# EAGLE design megacard_4 (EAGLE 4.16)
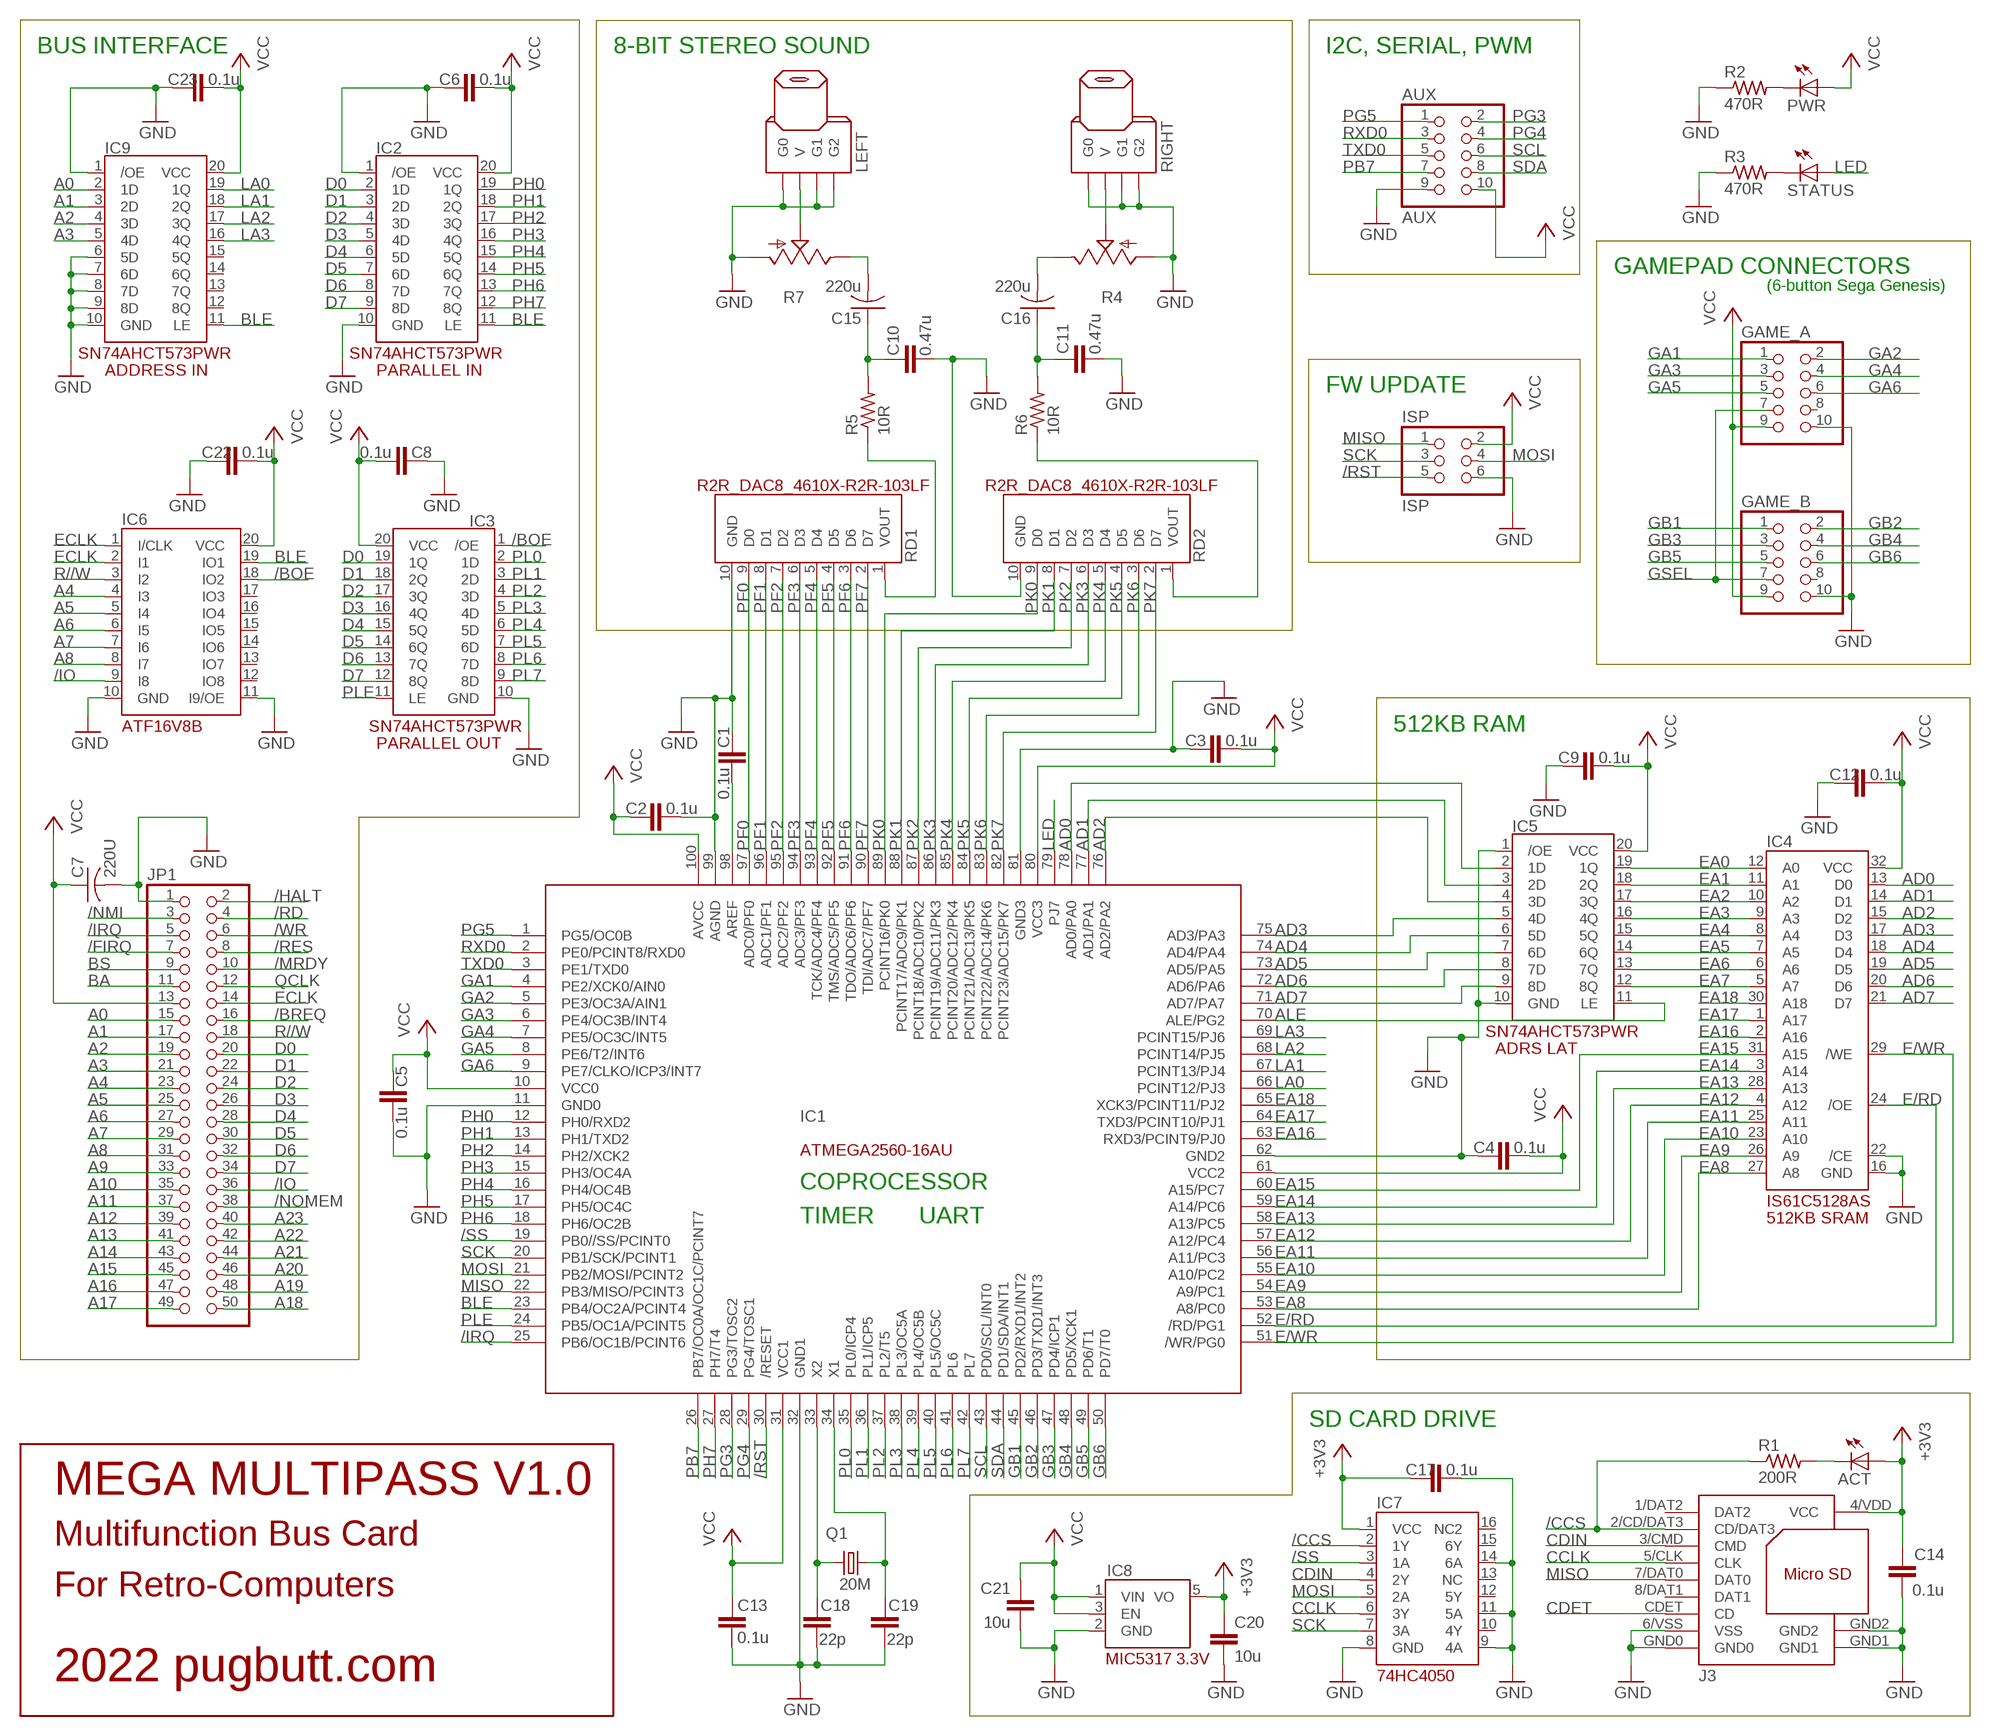
[diagram p0: schematic, sheet 1]

## Parts
ACT  LED3MM  [LED3MM]
AUX  AUX  PINHD-2X5  [2X05]
C1  0.1u  C-EUC0603  [C0603]
C2  0.1u  C-EUC0603  [C0603]
C3  0.1u  C-EUC0603  [C0603]
C4  0.1u  C-EUC0603  [C0603]
C5  0.1u  C-EUC0603  [C0603]
C6  0.1u  C-EUC0603  [C0603]
C7  220U  C-US025-050X050  [C025-050X050]
C8  0.1u  C-EUC0603  [C0603]
C9  0.1u  C-EUC0603  [C0603]
C10  0.47u  C-EUC0805  [C0805]
C11  0.47u  C-EUC0805  [C0805]
C12  0.1u  C-EUC0603  [C0603]
C13  0.1u  C-EUC0603  [C0603]
C14  0.1u  C-EUC0603  [C0603]
C15  220u  C-US025-050X050  [C025-050X050]
C16  220u  C-US025-050X050  [C025-050X050]
C17  0.1u  C-EUC0603  [C0603]
C18  22p  C-EUC0603  [C0603]
C19  22p  C-EUC0603  [C0603]
C20  10u  C-EUC0805  [C0805]
C21  10u  C-EUC0805  [C0805]
C22  0.1u  C-EUC0603  [C0603]
C23  0.1u  C-EUC0603  [C0603]
GAME_A  PINHD-2X5  [2X05]
GAME_B  PINHD-2X5  [2X05]
IC1  ATMEGA2560  [TQFP100]
IC2  SN74AHCT573PWR  [TSSOP20]
IC3  SN74AHCT573PWR  [TSSOP20]
IC4  IS61C5128AS  [SOIC32_11.3MM_WID]
IC5  SN74AHCT573PWR  [TSSOP20]
IC6  PLD_ATF16V8B  [DIL20]
IC7  CD74HC4050  [SO-16]
IC8  MIC5317_3.3V  [SOT23-5]
IC9  SN74AHCT573PWR  [TSSOP20]
ISP  ISP  PINHD-2X3  [2X03]
J3  MICROSD_AMPHENOL_GTFP084328  [MICROSD_AMPHENOL_GTFP08432B1HR]
JP1  PINHD-2X25  [2X25]
LEFT  RCA_CONN_CUI_RCJ-014_CP-1403-ND  [RCA_JACK_CUI_RCJ-014_CP-1403-ND]
PWR  LED3MM  [LED3MM]
Q1  20M  CRYSTALHC49U-V  [HC49U-V]
R1  200R  R-US_R0603  [R0603]
R2  470R  R-US_R0603  [R0603]
R3  470R  R-US_R0603  [R0603]
R4  TRIM_US-CA6V  [CA6V]
R5  10R  R-US_R0603  [R0603]
R6  10R  R-US_R0603  [R0603]
R7  TRIM_US-CA6V  [CA6V]
RD1  R2R_DAC8_4610X-R2R-103LF  [R2R_DAC_8BIT]
RD2  R2R_DAC8_4610X-R2R-103LF  [R2R_DAC_8BIT]
RIGHT  RCA_CONN_CUI_RCJ-014_CP-1403-ND  [RCA_JACK_CUI_RCJ-014_CP-1403-ND]
STATUS  LED3MM  [LED3MM]

## Nets
+3V3: ACT.A C14.1 C17.1 C20.1 IC7.1(VCC) IC8.5(VO) J3.4/VDD(VCC)
/BOE: IC3.1(/OE) IC6.18(IO2)
/BREQ: JP1.16
/CCS: IC7.2(1Y) J3.2/CD/DAT3(CD/DAT3) R1.1
/FIRQ: JP1.7
/HALT: JP1.2
/IO: IC6.9(I8) JP1.36
/IRQ: IC1.25(PB6/OC1B/PCINT6) JP1.5
/MRDY: JP1.10
/NMI: JP1.3
/NOMEM: JP1.38
/RD: JP1.4
/RES: JP1.8
/RST: IC1.30(/RESET) ISP.5
/SS: IC1.19(PB0//SS/PCINT0) IC7.3(1A)
/WR: JP1.6
A0: IC9.2(1D) JP1.15
A1: IC9.3(2D) JP1.17
A2: IC9.4(3D) JP1.19
A3: IC9.5(4D) JP1.21
A4: IC6.4(I3) JP1.23
A5: IC6.5(I4) JP1.25
A6: IC6.6(I5) JP1.27
A7: IC6.7(I6) JP1.29
A8: IC6.8(I7) JP1.31
A9: JP1.33
A10: JP1.35
A11: JP1.37
A12: JP1.39
A13: JP1.41
A14: JP1.43
A15: JP1.45
A16: JP1.47
A17: JP1.49
A18: JP1.50
A19: JP1.48
A20: JP1.46
A21: JP1.44
A22: JP1.42
A23: JP1.40
AD0: IC1.78(AD0/PA0) IC4.13(D0) IC5.2(1D)
AD1: IC1.77(AD1/PA1) IC4.14(D1) IC5.3(2D)
AD2: IC1.76(AD2/PA2) IC4.15(D2) IC5.4(3D)
AD3: IC1.75(AD3/PA3) IC4.17(D3) IC5.5(4D)
AD4: IC1.74(AD4/PA4) IC4.18(D4) IC5.6(5D)
AD5: IC1.73(AD5/PA5) IC4.19(D5) IC5.7(6D)
AD6: IC1.72(AD6/PA6) IC4.20(D6) IC5.8(7D)
AD7: IC1.71(AD7/PA7) IC4.21(D7) IC5.9(8D)
ALE: IC1.70(ALE/PG2) IC5.11(LE)
BA: JP1.11
BLE: IC1.23(PB4/OC2A/PCINT4) IC2.11(LE) IC6.19(IO1) IC9.11(LE)
BS: JP1.9
CCLK: IC7.6(3Y) J3.5/CLK(CLK)
CDET: J3.CDET(CD)
CDIN: IC7.4(2Y) J3.3/CMD(CMD)
D0: IC2.2(1D) IC3.19(1Q) JP1.20
D1: IC2.3(2D) IC3.18(2Q) JP1.22
D2: IC2.4(3D) IC3.17(3Q) JP1.24
D3: IC2.5(4D) IC3.16(4Q) JP1.26
D4: IC2.6(5D) IC3.15(5Q) JP1.28
D5: IC2.7(6D) IC3.14(6Q) JP1.30
D6: IC2.8(7D) IC3.13(7Q) JP1.32
D7: IC2.9(8D) IC3.12(8Q) JP1.34
E/RD: IC1.52(/RD/PG1) IC4.24(/OE)
E/WR: IC1.51(/WR/PG0) IC4.29(/WE)
EA0: IC4.12(A0) IC5.19(1Q)
EA1: IC4.11(A1) IC5.18(2Q)
EA2: IC4.10(A2) IC5.17(3Q)
EA3: IC4.9(A3) IC5.16(4Q)
EA4: IC4.8(A4) IC5.15(5Q)
EA5: IC4.7(A5) IC5.14(6Q)
EA6: IC4.6(A6) IC5.13(7Q)
EA7: IC4.5(A7) IC5.12(8Q)
EA8: IC1.53(A8/PC0) IC4.27(A8)
EA9: IC1.54(A9/PC1) IC4.26(A9)
EA10: IC1.55(A10/PC2) IC4.23(A10)
EA11: IC1.56(A11/PC3) IC4.25(A11)
EA12: IC1.57(A12/PC4) IC4.4(A12)
EA13: IC1.58(A13/PC5) IC4.28(A13)
EA14: IC1.59(A14/PC6) IC4.3(A14)
EA15: IC1.60(A15/PC7) IC4.31(A15)
EA16: IC1.63(RXD3/PCINT9/PJ0) IC4.2(A16)
EA17: IC1.64(TXD3/PCINT10/PJ1) IC4.1(A17)
EA18: IC1.65(XCK3/PCINT11/PJ2) IC4.30(A18)
ECLK: IC6.1(I/CLK) IC6.2(I1) JP1.14
GA1: GAME_A.1 IC1.4(PE2/XCK0/AIN0)
GA2: GAME_A.2 IC1.5(PE3/OC3A/AIN1)
GA3: GAME_A.3 IC1.6(PE4/OC3B/INT4)
GA4: GAME_A.4 IC1.7(PE5/OC3C/INT5)
GA5: GAME_A.5 IC1.8(PE6/T2/INT6)
GA6: GAME_A.6 IC1.9(PE7/CLKO/ICP3/INT7)
GB1: GAME_B.1 IC1.45(PD2/RXD1/INT2)
GB2: GAME_B.2 IC1.46(PD3/TXD1/INT3)
GB3: GAME_B.3 IC1.47(PD4/ICP1)
GB4: GAME_B.4 IC1.48(PD5/XCK1)
GB5: GAME_B.5 IC1.49(PD6/T1)
GB6: GAME_B.6 IC1.50(PD7/T0)
GND: AUX.9 C1.1 C2.2 C3.1 C4.1 C5.2 C6.1 C7.2 C8.1 C9.1 C10.2 C11.2 C12.1 C13.2 C14.2 C17.2 C18.2 C19.2 C20.2 C21.2 C22.1 C23.1 GAME_A.10 GAME_B.10 IC1.11(GND0) IC1.32(GND1) IC1.62(GND2) IC1.81(GND3) IC1.99(AGND) IC2.1(/OE) IC2.10(GND) IC3.10(GND) IC4.16(GND) IC4.22(/CE) IC5.1(/OE) IC5.10(GND) IC6.10(GND) IC6.11(I9/OE) IC7.8(GND) IC7.9(4A) IC7.11(5A) IC7.14(6A) IC8.2(GND) IC9.1(/OE) IC9.6(5D) IC9.7(6D) IC9.8(7D) IC9.9(8D) IC9.10(GND) ISP.6 J3.6/VSS(VSS) J3.GND0 J3.GND1 J3.GND2 JP1.1 LEFT.G0 LEFT.G1 LEFT.G2 R2.1 R3.1 R4.A R7.A RD1.10(GND) RD2.10(GND) RIGHT.G0 RIGHT.G1 RIGHT.G2
GSEL: GAME_A.7 GAME_B.7
LA0: IC1.66(PCINT12/PJ3) IC9.19(1Q)
LA1: IC1.67(PCINT13/PJ4) IC9.18(2Q)
LA2: IC1.68(PCINT14/PJ5) IC9.17(3Q)
LA3: IC1.69(PCINT15/PJ6) IC9.16(4Q)
LED: IC1.79(PJ7) STATUS.A
LOUT: R6.1 RD2.1(VOUT)
MISO: IC1.22(PB3/MISO/PCINT3) ISP.1 J3.7/DAT0(DAT0)
MOSI: IC1.21(PB2/MOSI/PCINT2) IC7.5(2A) ISP.4
N$1: PWR.K(C) R2.2
N$2: C11.1 C16.1 R6.2
N$3: ACT.K(C) R1.2
N$4: C18.1 IC1.33(X2) Q1.2
N$5: C19.1 IC1.34(X1) Q1.1
N$6: LEFT.V R7.S
N$7: R4.S RIGHT.V
N$8: R3.2 STATUS.K(C)
N$10: C15.2 R7.E
N$11: C10.1 C15.1 R5.2
N$12: C16.2 R4.E
N$27: C1.2 IC1.98(AREF)
PB7: AUX.7 IC1.26(PB7/OC0A/OC1C/PCINT7)
PF0: IC1.97(ADC0/PF0) RD1.9(D0)
PF1: IC1.96(ADC1/PF1) RD1.8(D1)
PF2: IC1.95(ADC2/PF2) RD1.7(D2)
PF3: IC1.94(ADC3/PF3) RD1.6(D3)
PF4: IC1.93(TCK/ADC4/PF4) RD1.5(D4)
PF5: IC1.92(TMS/ADC5/PF5) RD1.4(D5)
PF6: IC1.91(TDO/ADC6/PF6) RD1.3(D6)
PF7: IC1.90(TDI/ADC7/PF7) RD1.2(D7)
PG3: AUX.2 IC1.28(PG3/TOSC2)
PG4: AUX.4 IC1.29(PG4/TOSC1)
PG5: AUX.1 IC1.1(PG5/OC0B)
PH0: IC1.12(PH0/RXD2) IC2.19(1Q)
PH1: IC1.13(PH1/TXD2) IC2.18(2Q)
PH2: IC1.14(PH2/XCK2) IC2.17(3Q)
PH3: IC1.15(PH3/OC4A) IC2.16(4Q)
PH4: IC1.16(PH4/OC4B) IC2.15(5Q)
PH5: IC1.17(PH5/OC4C) IC2.14(6Q)
PH6: IC1.18(PH6/OC2B) IC2.13(7Q)
PH7: IC1.27(PH7/T4) IC2.12(8Q)
PK0: IC1.89(PCINT16/PK0) RD2.9(D0)
PK1: IC1.88(PCINT17/ADC9/PK1) RD2.8(D1)
PK2: IC1.87(PCINT18/ADC10/PK2) RD2.7(D2)
PK3: IC1.86(PCINT19/ADC11/PK3) RD2.6(D3)
PK4: IC1.85(PCINT20/ADC12/PK4) RD2.5(D4)
PK5: IC1.84(PCINT21/ADC13/PK5) RD2.4(D5)
PK6: IC1.83(PCINT22/ADC14/PK6) RD2.3(D6)
PK7: IC1.82(PCINT23/ADC15/PK7) RD2.2(D7)
PL0: IC1.35(PL0/ICP4) IC3.2(1D)
PL1: IC1.36(PL1/ICP5) IC3.3(2D)
PL2: IC1.37(PL2/T5) IC3.4(3D)
PL3: IC1.38(PL3/OC5A) IC3.5(4D)
PL4: IC1.39(PL4/OC5B) IC3.6(5D)
PL5: IC1.40(PL5/OC5C) IC3.7(6D)
PL6: IC1.41(PL6) IC3.8(7D)
PL7: IC1.42(PL7) IC3.9(8D)
PLE: IC1.24(PB5/OC1A/PCINT5) IC3.11(LE)
QCLK: JP1.12
R//W: IC6.3(I2) JP1.18
ROUT: R5.1 RD1.1(VOUT)
RXD0: AUX.3 IC1.2(PE0/PCINT8/RXD0)
SCK: IC1.20(PB1/SCK/PCINT1) IC7.7(3A) ISP.3
SCL: AUX.6 IC1.43(PD0/SCL/INT0)
SDA: AUX.8 IC1.44(PD1/SDA/INT1)
TXD0: AUX.5 IC1.3(PE1/TXD0)
VCC: AUX.10 C2.1 C3.2 C4.2 C5.1 C6.2 C7.1 C8.2 C9.2 C12.2 C13.1 C21.1 C22.2 C23.2 GAME_A.9 GAME_B.9 IC1.10(VCC0) IC1.31(VCC1) IC1.61(VCC2) IC1.80(VCC3) IC1.100(AVCC) IC2.20(VCC) IC3.20(VCC) IC4.32(VCC) IC5.20(VCC) IC6.20(VCC) IC8.1(VIN) IC8.3(EN) IC9.20(VCC) ISP.2 JP1.13 PWR.A
Unconnected: GAME_A.8 GAME_B.8 IC6.12(IO8) IC6.13(IO7) IC6.14(IO6) IC6.15(IO5) IC6.16(IO4) IC6.17(IO3) IC7.10(4Y) IC7.12(5Y) IC7.13(NC) IC7.15(6Y) IC7.16(NC2) IC9.12(8Q) IC9.13(7Q) IC9.14(6Q) IC9.15(5Q) J3.1/DAT2(DAT2) J3.8/DAT1(DAT1)

## Notes on the sheet
- BUS INTERFACE | 8-BIT STEREO SOUND | I2C, SERIAL, PWM
- GAMEPAD CONNECTORS
- (6-button Sega Genesis)
- ADDRESS IN | PARALLEL IN
- FW UPDATE
- 512KB RAM
- PARALLEL OUT
- ADRS LAT
- COPROCESSOR
- TIMER | UART | 512KB SRAM
- SD CARD DRIVE
- MEGA MULTIPASS V1.0
- Multifunction Bus Card
- For Retro-Computers
- 2022 pugbutt.com

## Library data of the parts
ACT PWR STATUS = led:LED: LED OSRAM: - CHIPLED LG R971, LG N971, LY N971, LG Q971, LY Q971, LO R971, LY R971 LH N974, LH R974 LS Q976, LO Q976, LY Q976 LO Q996 - Hyper CHIPLED LW Q18S LB Q993, LB Q99A, LB R99A - SideLED LS A670, LO A670, LY A670, LG A670, LP A670 LB A673, LV A673, LT A673, LW A673 LH A674 LY A675 LS A676, LA A676, LO A676, LY A676, LW A676 LS A679, LY A679, LG A679 - Hyper Micro SIDELED® LS Y876, LA Y876, LO Y876, LY Y876 LT Y87S - SmartLED LW L88C, LW L88S LB L89C, LB L89S, LG L890 LS L89K, LO L89K, LY L89K LS L896, LA L896, LO L896, LY L896 - TOPLED LS T670, LO T670, LY T670, LG T670, LP T670 LSG T670, LSP T670, LSY T670, LOP T670, LYG T670 LG T671, LOG T671, LSG T671 LB T673, LV T673, LT T673, LW T673 LH T674 LS T676, LA T676, LO T676, LY T676, LB T676, LH T676, LSB T676, LW T676 LB T67C, LV T67C, LT T67C, LS T67K, LO T67K, LY T67K, LW E67C LS E67B, LA E67B, LO E67B, LY E67B, LB E67C, LV E67C, LT E67C LW T67C LS T679, LY T679, LG T679 LS T770, LO T770, LY T770, LG T770, LP T770 LB T773, LV T773, LT T773, LW T773 LH T774 LS E675, LA E675, LY E675, LS T675 LS T776, LA T776, LO T776, LY T776, LB T776 LHGB T686 LT T68C, LB T68C - Hyper Mini TOPLED® LB M676 - Mini TOPLED Santana® LG M470 LS M47K, LO M47K, LY M47K Source: http://www.osram.convergy.de - LUMILED® LXK2-PW12-R00, LXK2-PW12-S00, LXK2-PW14-U00, LXK2-PW14-V00 LXK2-PM12-R00, LXK2-PM12-S00, LXK2-PM14-U00 LXK2-PE12-Q00, LXK2-PE12-R00, LXK2-PE12-S00, LXK2-PE14-T00, LXK2-PE14-U00 LXK2-PB12-K00, LXK2-PB12-L00, LXK2-PB12-M00, LXK2-PB14-N00, LXK2-PB14-P00, LXK2-PB14-Q00 LXK2-PR12-L00, LXK2-PR12-M00, LXK2-PR14-Q00, LXK2-PR14-R00 LXK2-PD12-Q00, LXK2-PD12-R00, LXK2-PD12-S00 LXK2-PH12-R00, LXK2-PH12-S00 LXK2-PL12-P00, LXK2-PL12-Q00, LXK2-PL12-R00 Source: www.luxeon.com
AUX GAME_A GAME_B = pinhead:PINHD-2X5: PIN HEADER
C1-C6 C8-C14 C17-C23 = rcl:C-EU: CAPACITOR, European symbol
C7 C15 C16 = rcl:C-US: CAPACITOR, American symbol
IC1 = 02_atmel:ATMEGA2560
IC2 IC3 IC5 IC9 = 07-Retrocomputing:SN74AHCT573PWR
IC4 = 07-Retrocomputing:IS61C5128AS
IC6 = 07-Retrocomputing:PLD_ATF16V8B
IC7 = 07-Retrocomputing:CD74HC4050
IC8 = 07-Retrocomputing:MIC5317_3.3V
ISP = pinhead:PINHD-2X3: PIN HEADER
J3 = 07-Retrocomputing:MICROSD_AMPHENOL_GTFP084328
JP1 = pinhead:PINHD-2X25: PIN HEADER
LEFT RIGHT = 07-Retrocomputing:RCA_CONN_CUI_RCJ-014_CP-1403-ND
Q1 = crystal:CRYSTAL: CRYSTAL
R1-R3 R5 R6 = rcl:R-US_: RESISTOR, American symbol
R4 R7 = pot:TRIM_US-: POTENTIOMETER
RD1 RD2 = 07-Retrocomputing:R2R_DAC8_4610X-R2R-103LF

## Net classes
0 default: width 0.203 mm, drill 0.203 mm, clearance 0.254 mm
1 supply: width 0.61 mm, drill 0.203 mm, clearance 0.305 mm

## Board
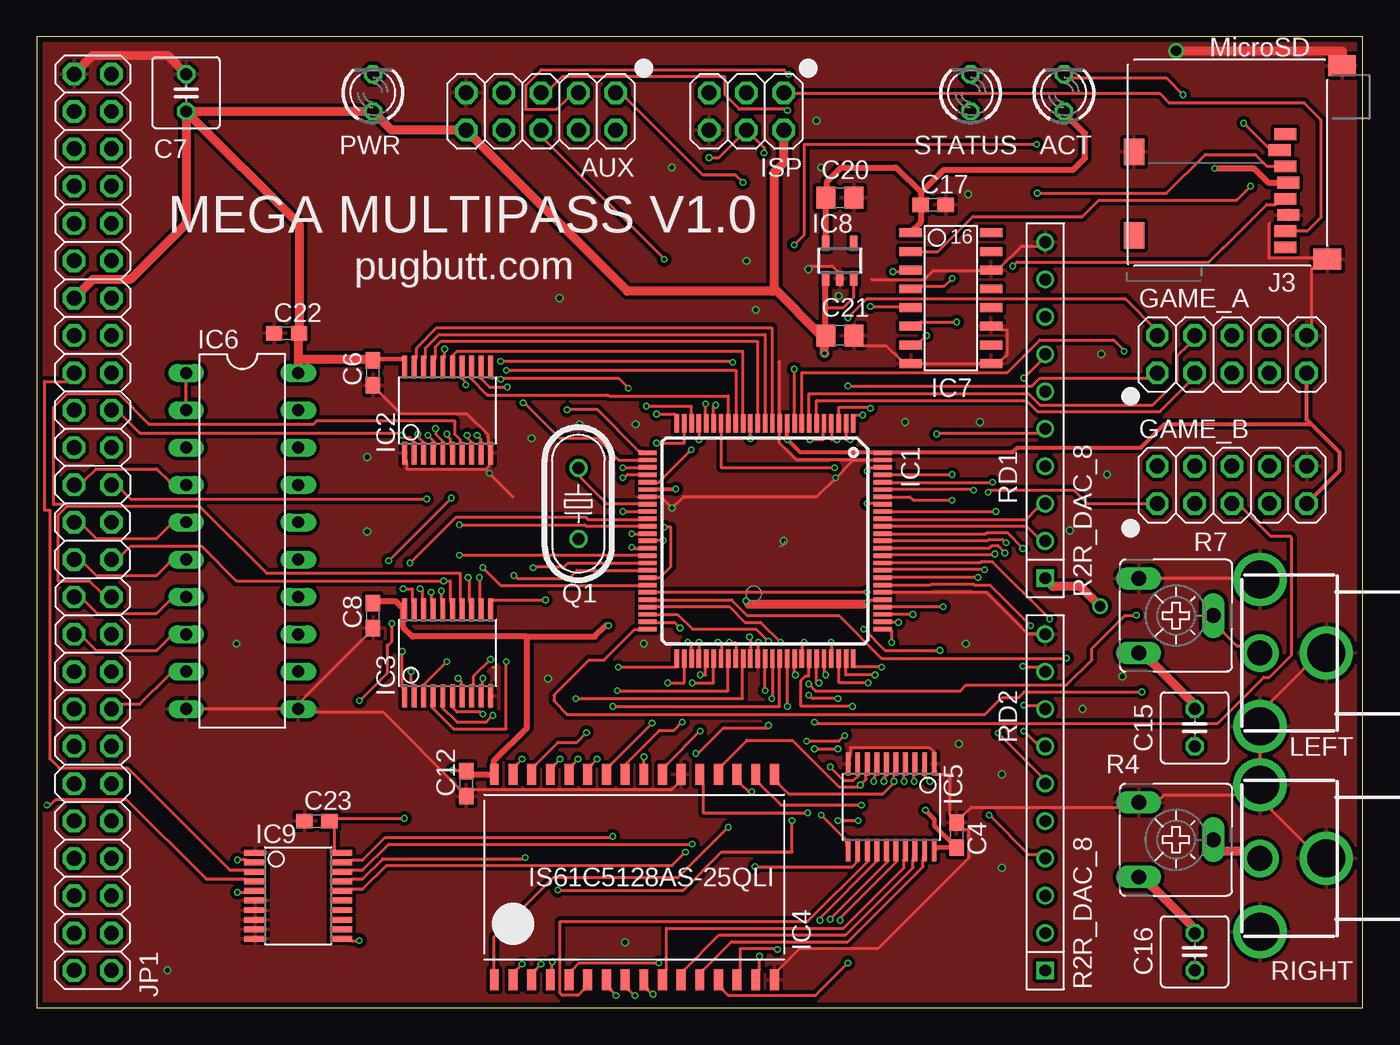
[diagram p1: board, top side]
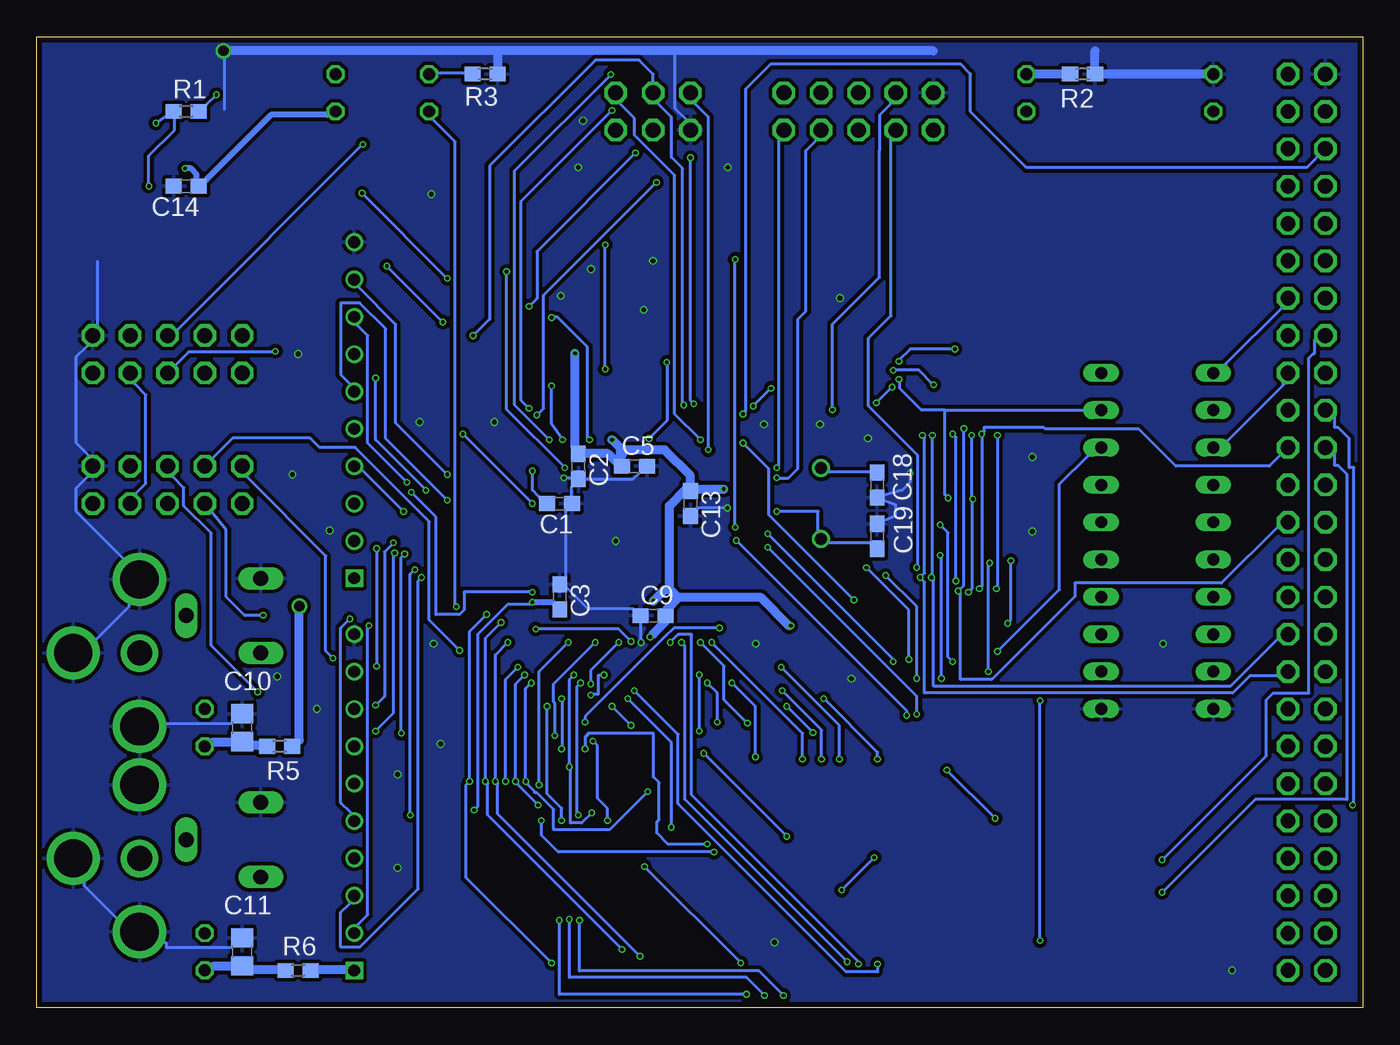
[diagram p2: board, bottom side, seen from below]

Size 90.17 x 66.04 mm. Coordinates in mm from the lower left corner, seen from the top.
Outline: 0,0 90.17,0 90.17,66.04 0,66.04 0,0
Copper layers (1*2*15*16): Top 0.0356mm / dielectric 0.1702mm / Route2 0.0178mm / dielectric 1.1938mm / Route15 0.0178mm / dielectric 0.1702mm / Bottom 0.0356mm
Design rules "oshpark-4layer": minimum track width 5mil, minimum drill 10mil, track to track 5mil, track to pad 5mil, pad to pad 5mil, via to via 5mil, smd to smd 5mil, copper to edge 15mil, drill to drill 6mil, minimum pad ring 4mil, minimum via ring 4mil, stop-mask expansion 2.5mil, vias tented up to drill 0mil, thermal gap 10mil

### Footprints (pad centres in the part's own frame; a part is rotated, then mirrored left to right if it is on the bottom)
LED3MM = drill 0.813 octagon: A -1.27,0; K 1.27,0
2X05 = drill 1.016 octagon: 1 -5.08,-1.27; 2 -5.08,1.27; 3 -2.54,-1.27; 4 -2.54,1.27; 5 0,-1.27; 6 0,1.27; 7 2.54,-1.27; 8 2.54,1.27; 9 5.08,-1.27; 10 5.08,1.27
C0603 = smd 1.1 x 1: 1 -0.85,0; 2 0.85,0
C025-050X050 = drill 0.813 octagon: 1 -1.27,0; 2 1.27,0
C0805 = smd 1.3 x 1.5: 1 -0.95,0; 2 0.95,0
TQFP100 = smd 1.25 x 0.3: 1 -8,6; 2 -8,5.5; 3 -8,5; 4 -8,4.5; 5 -8,4; 6 -8,3.5; 7 -8,3; 8 -8,2.5; 9 -8,2; 10 -8,1.5; 11 -8,1; 12 -8,0.5; 13 -8,0; 14 -8,-0.5; 15 -8,-1; 16 -8,-1.5; 17 -8,-2; 18 -8,-2.5; 19 -8,-3; 20 -8,-3.5; 21 -8,-4; 22 -8,-4.5; 23 -8,-5; 24 -8,-5.5; 25 -8,-6; 51 8,-6; 52 8,-5.5; 53 8,-5; 54 8,-4.5; 55 8,-4; 56 8,-3.5; 57 8,-3; 58 8,-2.5; 59 8,-2; 60 8,-1.5; 61 8,-1; 62 8,-0.5; 63 8,0; 64 8,0.5; 65 8,1; 66 8,1.5; 67 8,2; 68 8,2.5; 69 8,3; 70 8,3.5; 71 8,4; 72 8,4.5; 73 8,5; 74 8,5.5; 75 8,6 | smd 0.3 x 1.25: 26 -6,-8; 27 -5.5,-8; 28 -5,-8; 29 -4.5,-8; 30 -4,-8; 31 -3.5,-8; 32 -3,-8; 33 -2.5,-8; 34 -2,-8; 35 -1.5,-8; 36 -1,-8; 37 -0.5,-8; 38 0,-8; 39 0.5,-8; 40 1,-8; 41 1.5,-8; 42 2,-8; 43 2.5,-8; 44 3,-8; 45 3.5,-8; 46 4,-8; 47 4.5,-8; 48 5,-8; 49 5.5,-8; 50 6,-8; 76 6,8; 77 5.5,8; 78 5,8; 79 4.5,8; 80 4,8; 81 3.5,8; 82 3,8; 83 2.5,8; 84 2,8; 85 1.5,8; 86 1,8; 87 0.5,8; 88 0,8; 89 -0.5,8; 90 -1,8; 91 -1.5,8; 92 -2,8; 93 -2.5,8; 94 -3,8; 95 -3.5,8; 96 -4,8; 97 -4.5,8; 98 -5,8; 99 -5.5,8; 100 -6,8
TSSOP20 = smd 1.5 x 0.35: 1 -2.925,2.925; 2 -2.925,2.275; 3 -2.925,1.625; 4 -2.925,0.975; 5 -2.925,0.325; 6 -2.925,-0.325; 7 -2.925,-0.975; 8 -2.925,-1.625; 9 -2.925,-2.275; 10 -2.925,-2.925; 11 2.925,-2.925; 12 2.925,-2.275; 13 2.925,-1.625; 14 2.925,-0.975; 15 2.925,-0.325; 16 2.925,0.325; 17 2.925,0.975; 18 2.925,1.625; 19 2.925,2.275; 20 2.925,2.925
SOIC32_11.3MM_WID = smd 1.4 x 0.6: 1 -6.985,9.525; 2 -6.985,8.255; 3 -6.985,6.985; 4 -6.985,5.715; 5 -6.985,4.445; 6 -6.985,3.175; 7 -6.985,1.905; 8 -6.985,0.635; 9 -6.985,-0.635; 10 -6.985,-1.905; 11 -6.985,-3.175; 12 -6.985,-4.445; 13 -6.985,-5.715; 14 -6.985,-6.985; 15 -6.985,-8.255; 16 -6.985,-9.525; 17 6.985,-9.525; 18 6.985,-8.255; 19 6.985,-6.985; 20 6.985,-5.715; 21 6.985,-4.445; 22 6.985,-3.175; 23 6.985,-1.905; 24 6.985,-0.635; 25 6.985,0.635; 26 6.985,1.905; 27 6.985,3.175; 28 6.985,4.445; 29 6.985,5.715; 30 6.985,6.985; 31 6.985,8.255; 32 6.985,9.525
DIL20 = drill 0.813 long: 1 -11.43,-3.81; 2 -8.89,-3.81; 3 -6.35,-3.81; 4 -3.81,-3.81; 5 -1.27,-3.81; 6 1.27,-3.81; 7 3.81,-3.81; 8 6.35,-3.81; 9 8.89,-3.81; 10 11.43,-3.81; 11 11.43,3.81; 12 8.89,3.81; 13 6.35,3.81; 14 3.81,3.81; 15 1.27,3.81; 16 -1.27,3.81; 17 -3.81,3.81; 18 -6.35,3.81; 19 -8.89,3.81; 20 -11.43,3.81
SO-16 = smd 0.61 x 1.524: 1 -4.445,-2.794; 2 -3.175,-2.794; 3 -1.905,-2.794; 4 -0.635,-2.794; 5 0.635,-2.794; 6 1.905,-2.794; 7 3.175,-2.794; 8 4.445,-2.794; 9 4.445,2.667; 10 3.175,2.667; 11 1.905,2.667; 12 0.635,2.667; 13 -0.635,2.667; 14 -1.905,2.667; 15 -3.175,2.667; 16 -4.445,2.667
SOT23-5 = smd 0.5 x 1: 1 -0.95,-1.2; 2 0,-1.2; 3 0.95,-1.2; 4 0.95,1.2; 5 -0.95,1.2
2X03 = drill 1.016 octagon: 1 -2.54,-1.27; 2 -2.54,1.27; 3 0,-1.27; 4 0,1.27; 5 2.54,-1.27; 6 2.54,1.27
MICROSD_AMPHENOL_GTFP08432B1HR = smd 0.8 x 1.5: 1/DAT2 1.95,-10.3; 2/CD/DAT3 0.85,-9.9; 3/CMD -0.25,-10.3; 4/VDD -1.35,-10.5; 5/CLK -2.45,-10.3; 6/VSS -3.55,-10.5; 7/DAT0 -4.65,-10.3; 8/DAT1 -5.75,-10.3 | smd 1.8 x 1.4: CDET -4.95,0; GND0 0.75,0 | smd 1.4 x 1.9: GND1 -6.55,-13.15; GND2 6.6,-14.15
2X25 = drill 1.016 octagon: 1 -30.48,-1.27; 2 -30.48,1.27; 3 -27.94,-1.27; 4 -27.94,1.27; 5 -25.4,-1.27; 6 -25.4,1.27; 7 -22.86,-1.27; 8 -22.86,1.27; 9 -20.32,-1.27; 10 -20.32,1.27; 11 -17.78,-1.27; 12 -17.78,1.27; 13 -15.24,-1.27; 14 -15.24,1.27; 15 -12.7,-1.27; 16 -12.7,1.27; 17 -10.16,-1.27; 18 -10.16,1.27; 19 -7.62,-1.27; 20 -7.62,1.27; 21 -5.08,-1.27; 22 -5.08,1.27; 23 -2.54,-1.27; 24 -2.54,1.27; 25 0,-1.27; 26 0,1.27; 27 2.54,-1.27; 28 2.54,1.27; 29 5.08,-1.27; 30 5.08,1.27; 31 7.62,-1.27; 32 7.62,1.27; 33 10.16,-1.27; 34 10.16,1.27; 35 12.7,-1.27; 36 12.7,1.27; 37 15.24,-1.27; 38 15.24,1.27; 39 17.78,-1.27; 40 17.78,1.27; 41 20.32,-1.27; 42 20.32,1.27; 43 22.86,-1.27; 44 22.86,1.27; 45 25.4,-1.27; 46 25.4,1.27; 47 27.94,-1.27; 48 27.94,1.27; 49 30.48,-1.27; 50 30.48,1.27
RCA_JACK_CUI_RCJ-014_CP-1403-ND = drill 2.6 round: G0 -5,0; G1 0,4.5; G2 5,0 | drill 1.7 round: V 0,0
HC49U-V = drill 0.813 round: 1 -2.413,0; 2 2.413,0
R0603 = smd 1.1 x 1: 1 -0.85,0; 2 0.85,0
CA6V = drill 1.016 long: A -2.54,-2.54; E 2.54,-2.54; S 0,2.54
R2R_DAC_8BIT = drill 0.8 square: 1 -11.43,0 | drill 0.8 round: 2 -8.89,0; 3 -6.35,0; 4 -3.81,0; 5 -1.27,0; 6 1.27,0; 7 3.81,0; 8 6.35,0; 9 8.89,0; 10 11.43,0

### Placement (x,y rotation side)
ACT  69.85,62.23 90 top
AUX  34.29,60.96 180 top
C1  54.61,34.29 180 bottom
C2  53.34,36.83 270 bottom
C3  54.61,27.94 270 bottom
C4  62.55,11.75 270 top
C5  49.53,36.83 0 bottom
C6  22.86,43.18 90 top
C7  10.16,62.23 90 top
C8  22.86,26.67 90 top
C9  48.26,26.67 0 bottom
C10  76.2,19.05 90 bottom
C11  76.2,3.81 90 bottom
C12  29.21,15.24 90 top
C13  45.72,34.29 270 bottom
C14  80.01,55.88 180 bottom
C15  78.74,19.05 90 top
C16  78.74,3.81 90 top
C17  60.96,54.61 0 top
C18  33.02,35.56 270 bottom
C19  33.02,32.07 90 bottom
C20  54.61,55.09 0 top
C21  54.61,45.72 0 top
C22  16.99,45.88 0 top
C23  19.05,12.7 0 top
GAME_A  81.28,44.45 0 top
GAME_B  81.28,35.56 0 top
IC1  49.53,31.75 270 top
IC2  27.94,40.64 90 top
IC3  27.94,24.13 90 top
IC4  40.64,8.89 90 top
IC5  58.1,13.65 270 top
IC6  13.97,31.75 270 top
IC7  62.23,48.26 270 top
IC8  54.61,50.8 0 top
IC9  17.78,7.62 0 top
ISP  48.26,60.96 180 top
J3  74.61,57.47 90 top
JP1  3.81,33.02 270 top
LEFT  83.19,24.13 270 top
PWR  22.86,62.23 90 top
Q1  36.83,34.29 90 top
R1  80.01,60.96 0 bottom
R2  19.05,63.5 180 bottom
R3  59.69,63.5 180 bottom
R4  77.47,11.43 270 top
R5  73.66,17.78 180 bottom
R6  72.39,2.54 180 bottom
R7  77.47,26.67 270 top
RD1  68.58,40.64 90 top
RD2  68.58,13.97 90 top
RIGHT  83.19,10.16 270 top
STATUS  63.5,62.23 90 top

### Tracks (layer width: path | path; a pad name or v marks a point on that pad's centre or on a via)
+3V3  (via drill 0.25)
  Top 0.203: 59.52,52.78 IC7.1 59.37,52.7 | 60.09,54.61 C17.1 60.11,55.43 | C20.1 53.74,55.17 | C20.1 | 53.74,55.09 | C20.1 53.74,55.09
  Top 0.406: IC8.5 C20.1 | 59.37,52.7 60.11,53.44 C17.1 60.11,55.46 58.42,57.15 54.69,57.15 53.74,56.2 53.74,55.09 | 60.11,55.43 61.67,56.99 70.48,56.99 71.28,57.78 71.28,59.45 69.85,60.88 ACT.A | v80.09,57.09 82.77,57.09 83.74,56.12 85.09,56.12 J3.4/VDD
  Bottom 0.203: 78.64,56.31 C14.1
  Bottom 0.406: 78.64,56.31 74.22,60.73 70.41,60.73 ACT.A | v80.09,57.09 79.71,57.09 79.3,56.67 79.3,56.04 79.14,55.88 C14.1
/BOE  (via drill 0.25)
  Top 0.203: v24.84,24.23 24.84,21.95 IC3.1
  Bottom 0.203: v24.84,24.23 20.62,28.45 20.62,35.61 18.67,37.57 IC6.18
/CCS  (via drill 0.25)
  Top 0.203: IC7.2 61.28,51.44 63.66,53.82 71.12,53.82 72.23,54.93 81.6,54.93 v82.55,55.88 | J3.2/CD/DAT3 83.92,58.32 v82.07,60.17
  Bottom 0.203: v82.55,55.88 82.55,57.94 80.8,59.69 80.8,60.96 | R1.1 80.86,61.06 80.8,61.12 80.8,60.96 | 80.8,60.96 R1.1 | R1.1 80.96,60.96 v82.07,60.17
/IO
  Top 0.203: IC6.9 8.99,22.63 7.01,20.65 5.79,20.65 JP1.36
/IRQ  (via drill 0.25)
  Top 0.203: v42.14,40.39 43.36,40.39 43.43,40.31 IC1.25
  Bottom 0.203: v42.14,40.39 41.99,40.54 41.99,62.46 40.28,64.16 27.33,64.16 26.67,63.5 26.67,60.96 22.86,57.15 3.81,57.15 JP1.5
/RST  (via drill 0.25)
  Top 0.203: v44.5,37.95 42.29,35.74 42.14,35.74 IC1.30
  Bottom 0.203: v44.5,37.95 44.5,60.58 45.41,61.49 ISP.5
/SS  (via drill 0.25)
  Top 0.203: v54.25,36.73 46.56,36.73 46.56,39.17 IC1.19 | v58.22,50.06 58.75,50.06 IC7.3
  Bottom 0.203: v54.25,36.73 58.22,40.69 v58.22,50.06
A0  (via drill 0.25)
  Top 0.203: v13.64,10.06 14.17,10.06 IC9.2
  Bottom 0.203: v13.64,10.06 6.55,17.14 6.55,20.95 6.1,21.41 3.66,21.41 3.66,44.2 3.35,44.5 3.28,44.5 3.28,45.41 JP1.15
A1
  Top 0.203: IC9.3 14.17,9.37 13.11,9.37 6.17,16.31 1.52,16.31 0.91,16.92 0.91,33.83 0.53,33.83 0.53,42.6 2.06,42.6 JP1.17
A2  (via drill 0.25)
  Top 0.203: v0.69,13.79 0.91,13.79 1.29,14.17 6.1,14.17 11.51,8.76 14.17,8.76 IC9.4
  Bottom 0.203: v0.69,13.79 0.61,13.79 0.61,36.73 0.91,36.73 0.91,38.71 1.68,39.47 1.91,39.47 1.91,40.23 JP1.19
A3  (via drill 0.25)
  Top 0.203: v13.64,7.85 14.17,7.85 IC9.5
  Bottom 0.203: v13.64,7.85 7.32,14.17 1.07,14.17 1.07,36.27 1.68,36.88 1.91,36.88 1.91,37.72 JP1.21
A4
  Top 0.203: IC6.4 8.99,35.81 8.15,36.65 4.04,36.65 3.28,35.89 JP1.23
A5
  Top 0.203: IC6.5 8.99,32.77 8.15,31.93 4.04,31.93 3.28,32.69 JP1.25
A6
  Top 0.203: IC6.6 8.99,30.25 8.15,29.41 4.04,29.41 3.28,30.18 JP1.27
A7
  Top 0.203: IC6.7 8.99,27.66 8.15,26.82 4.12,26.82 3.28,27.66 JP1.29
A8
  Top 0.203: IC6.8 8.99,25.15 8.15,24.31 4.04,24.31 3.28,25.07 JP1.31
AD0  (via drill 0.25)
  Top 0.203: v59.59,26.75 58.14,26.75 IC1.78 | v60.73,15.39 60.27,15.85 IC5.2 | v55.17,3.05 52.96,0.84 47.02,0.84 46.63,1.22 IC4.13
  Bottom 0.203: v59.59,26.75 60.73,25.6 v60.73,15.39 60.96,15.16 60.96,8.84 v55.17,3.05
AD1  (via drill 0.25)
  Top 0.203: v58.6,26.21 58.14,26.21 IC1.77 | v59.66,15.39 59.66,15.85 IC5.3 | v50.37,3.96 50.29,4.04 47.85,4.04 47.85,2.59 IC4.14
  Bottom 0.203: v58.6,26.21 59.66,25.15 v59.66,15.39 59.51,15.24 59.51,13.11 v50.37,3.96
AD2  (via drill 0.25)
  Top 0.203: v58.14,24.84 58.14,25.6 IC1.76 | v58.98,15.39 58.98,15.85 IC5.4 | v49.15,3.5 49.15,2.59 IC4.15
  Bottom 0.203: v58.14,24.84 58.98,24 v58.98,15.39 58.83,15.24 58.83,13.18 v49.15,3.5
AD3  (via drill 0.25)
  Top 0.203: v57.45,23.16 55.63,23.16 IC1.75 | IC5.5 58.29,15.85 v58.29,15.39 58.22,15.24 57.53,14.55 51.13,14.55 50.44,15.24 IC4.17
  Bottom 0.203: v57.45,23.16 58.29,22.33 v58.29,15.39
AD4  (via drill 0.25)
  Top 0.203: v57,22.63 55.02,22.63 55.02,23.16 IC1.74 | v57.61,15.39 57.61,15.7 57.68,15.7 57.84,15.85 IC5.6 | v56.08,13.79 50.6,13.79 49.15,15.24 IC4.18
  Bottom 0.203: v57,22.63 57.61,22.02 v57.61,15.39 57.45,15.24 57.45,15.16 v56.08,13.79
AD5  (via drill 0.25)
  Top 0.203: v56.54,22.1 54.56,22.1 54.56,23.16 IC1.73 | v56.92,15.39 56.92,15.62 57,15.62 57,15.85 IC5.7 | v48.62,14.71 48.39,14.71 47.85,15.24 IC4.19
  Bottom 0.203: v56.54,22.1 56.92,21.72 v56.92,15.39 56.77,15.24 56.77,15.16 56.31,14.71 56.31,14.63 56.16,14.63 55.02,13.49 55.02,12.12 51.21,12.12 v48.62,14.71
AD6  (via drill 0.25)
  Top 0.203: v54.03,24.84 54.03,24.31 IC1.72 | IC5.8 56.39,15.85 56.39,15.54 v56.01,15.16 55.85,15.01 54.56,15.01 51.38,18.19 48.28,18.19 46.63,16.54 IC4.20
  Bottom 0.203: v54.03,24.84 56.01,22.86 v56.01,15.16
AD7  (via drill 0.25)
  Top 0.203: v53.65,22.63 53.57,22.63 53.57,23.16 IC1.71 | v53.95,16.38 54.86,15.47 55.55,15.47 55.93,15.85 IC5.9 | v52.43,13.26 45.34,13.26 45.34,15.24 IC4.21
  Bottom 0.203: v53.65,22.63 53.95,22.33 v53.95,16.38 53.87,16.23 53.87,12.57 53.11,12.57 v52.43,13.26
ALE  (via drill 0.25)
  Top 0.203: v53.19,22.1 53.03,22.1 53.03,23.16 IC1.70 | v53.34,13.11 55.02,11.43 IC5.11
  Bottom 0.203: v53.19,22.1 53.42,21.87 53.42,13.18 v53.34,13.11
BLE  (via drill 0.25)
  Top 0.203: v41.45,40.92 44.5,40.92 44.5,40.31 IC1.23 | v40.23,42.14 39.55,42.82 31.55,42.82 | 31.55,42.82 31.01,42.82 IC2.11 | v31.55,42.75 31.55,42.82 | v21.95,4.57 21.41,4.57 IC9.11 | v21.95,20.88 23.85,22.78 23.85,24.69 23.93,24.69 24.16,24.92 v24.16,26.14 | v23.93,30.4 v28.19,34.67
  Bottom 0.203: v40.23,42.14 v41.45,40.92 | v31.55,42.75 31.47,42.67 31.47,42.11 30,40.64 28.42,40.64 | 28.42,40.64 IC6.19 | v21.95,4.57 v21.95,20.88 | v24.16,26.14 23.93,26.36 v23.93,30.4 | v28.19,34.67 28.42,34.9 28.42,40.64
CCLK  (via drill 0.25)
  Top 0.203: v62.56,46.63 60.12,46.63 IC7.6 | J3.5/CLK 84.2,54.63 83.64,54.63 80.72,51.71 80.69,51.71 79.69,50.72 66.65,50.72 v66.37,50.44
  Bottom 0.203: v62.56,46.63 v66.37,50.44
CDIN  (via drill 0.25)
  Top 0.203: v62.26,49.61 61.72,49.07 60.12,49.07 IC7.4 | v68.05,55.4 76.83,55.4 79.45,58.02 82.87,58.02 83.66,57.23 85.01,57.23 85.02,57.22 | 85.02,57.22 85.09,57.15 | 85.02,57.22 J3.3/CMD
  Bottom 0.203: v62.26,49.61 v68.05,55.4
D0  (via drill 0.25)
  Top 0.203: v24.92,28.5 25.53,28.5 25.53,27.74 IC3.19 | IC2.2 25.76,38.41 25.38,38.79 24.99,38.79 v24.84,38.94 24.69,39.09 7.01,39.09 5.79,40.31 JP1.20
  Bottom 0.203: v24.92,28.5 24.84,28.57 v24.84,38.94
D1  (via drill 0.25)
  Top 0.203: v26.06,28.5 26.21,28.5 26.21,27.74 IC3.18 | v25.91,39.01 25.91,38.86 26.36,38.41 IC2.3
  Bottom 0.203: v26.06,28.5 25.91,28.65 v25.91,39.01 25.76,39.17 25.76,39.47 21.69,39.47 21.59,39.37 15.24,39.37 12.7,36.83 6.35,36.83 JP1.22
D2  (via drill 0.25)
  Top 0.203: v26.82,28.27 26.82,27.74 IC3.17 | v26.59,38.94 27.13,38.41 IC2.4 | v26.52,34.59 6.4,34.59 5.79,35.2 JP1.24
  Bottom 0.203: v26.82,28.27 26.59,28.5 26.59,34.59 | 26.59,34.59 v26.59,38.94 | v26.52,34.59 26.59,34.59
D3  (via drill 0.25)
  Top 0.203: v27.51,28.35 27.51,27.74 IC3.16 | v27.13,39.4 27.13,39.01 27.58,38.56 27.58,38.41 IC2.5
  Bottom 0.203: v27.13,39.4 27.13,28.73 v27.51,28.35 27.36,28.19 27.36,22.33 25.22,22.33 19.58,27.96 19.58,28.88 9.6,28.88 5.79,32.69 JP1.26
D4  (via drill 0.25)
  Top 0.203: IC3.15 28.12,27.74 28.12,29.03 v27.66,29.03 13.56,29.03 11.2,31.39 6.4,31.39 5.79,30.79 JP1.28 | v27.89,39.01 27.89,38.94 28.12,38.71 28.12,38.41 IC2.6
  Bottom 0.203: v27.89,39.01 27.66,38.79 v27.66,29.03
D5
  Top 0.203: 2.06,34.14 11.05,34.14 15.62,29.57 28.8,29.57 28.8,27.74 IC3.14 | 2.06,34.14 1.45,33.53 1.45,29.03 3.58,29.03 4.34,28.27 JP1.30 | IC2.7 28.8,38.41 28.8,38.63 28.42,39.01 28.42,39.93 19.05,39.93 18.82,39.7 7.62,39.7 5.56,41.76 2.06,41.76 1.14,40.84 1.14,34.21 2.06,34.21 2.06,34.14
D6  (via drill 0.25)
  Top 0.203: v29.34,29.26 29.41,29.26 29.41,27.74 IC3.13 | v29.26,38.94 29.26,38.79 29.64,38.41 IC2.8
  Bottom 0.203: v29.26,38.94 29.26,29.34 v29.34,29.26 29.18,29.11 29.18,21.87 8.99,21.87 5.79,25.07 JP1.32
D7  (via drill 0.25)
  Top 0.203: v30.1,29.26 30.1,27.74 IC3.12 | v29.95,38.94 30.18,38.71 30.18,38.41 IC2.9
  Bottom 0.203: v29.95,38.94 29.79,38.79 29.79,29.57 v30.1,29.26 29.79,28.96 29.79,21.41 8.84,21.41 7.7,22.55 5.79,22.55 JP1.34
E/RD  (via drill 0.25)
  Top 0.203: v42.9,22.1 44.04,22.1 44.04,23.16 IC1.52 | v41.3,17.07 41.3,16.54 IC4.24
  Bottom 0.203: v42.9,22.1 41.3,20.5 v41.3,17.07
E/WR  (via drill 0.25)
  Top 0.203: v39.55,23.16 43.43,23.16 IC1.51 | v35.59,16.92 35.2,16.54 IC4.29
  Bottom 0.203: v39.55,23.16 35.59,19.2 v35.59,16.92
EA0
  Top 0.203: IC4.12 45.34,2.59 47.24,4.5 55.17,4.5 60.27,9.6 60.27,9.98 IC5.19
EA1
  Top 0.203: IC4.11 44.04,2.59 46.41,4.95 55.02,4.95 59.59,9.53 59.59,9.98 IC5.18
EA2
  Top 0.203: IC4.10 42.82,2.59 42.82,5.41 54.86,5.41 58.98,9.53 58.98,9.98 IC5.17
EA3  (via drill 0.25)
  Top 0.203: v41.91,0.91 41.83,0.91 41.53,1.22 IC4.9 | v54.63,5.94 54.63,6.1 58.52,9.98 IC5.16
  Bottom 0.203: v41.91,0.91 54.63,0.91 v54.63,5.94
EA4  (via drill 0.25)
  Top 0.203: v40.69,0.84 40.62,0.84 40.23,1.22 IC4.8 | v53.95,6.02 57.91,9.98 IC5.15
  Bottom 0.203: v40.69,0.84 41.91,2.06 53.95,2.06 v53.95,6.02
EA5  (via drill 0.25)
  Top 0.203: v39.4,0.84 39.01,1.22 IC4.7 | v53.26,5.94 53.26,6.1 57.15,9.98 IC5.14
  Bottom 0.203: v39.4,0.84 41.07,2.52 53.26,2.52 v53.26,5.94
EA6
  Top 0.203: IC4.6 37.19,1.22 36.8,0.84 35.74,0.84 35.59,0.99 35.59,5.87 52.43,5.87 56.54,9.98 IC5.13
EA7  (via drill 0.25)
  Top 0.203: v42.29,3.05 36.88,3.05 36.42,2.59 IC4.5 | v48.84,9.6 55.47,9.6 55.85,9.98 IC5.12
  Bottom 0.203: v42.29,3.05 v48.84,9.6
EA8  (via drill 0.25)
  Top 0.203: v44.27,24.84 44.5,24.84 44.5,24.31 IC1.53 | v38.1,16.92 37.72,16.54 IC4.27
  Bottom 0.203: v44.27,24.84 38.1,18.67 v38.1,16.92
EA9  (via drill 0.25)
  Top 0.203: v45.03,24.84 45.03,24.31 IC1.54 | v41.83,19.36 39.01,16.54 IC4.26
  Bottom 0.203: v45.03,24.84 43.43,23.24 43.43,20.95 v41.83,19.36
EA10  (via drill 0.25)
  Top 0.203: v45.11,22.63 45.49,22.63 45.49,23.16 IC1.55 | v45.11,18.82 42.82,16.54 IC4.23
  Bottom 0.203: v45.11,18.82 v45.11,22.63
EA11  (via drill 0.25)
  Top 0.203: v44.58,22.1 46.02,22.1 46.02,23.16 IC1.56 | v43.89,19.43 43.33,18.87 42.34,18.87 40.01,16.54 IC4.25
  Bottom 0.203: v44.58,22.1 43.89,21.41 v43.89,19.43
EA12  (via drill 0.25)
  Top 0.203: v46.33,24.84 46.56,24.84 46.56,24.31 IC1.57 | v35.05,3.12 35.05,2.59 IC4.4
  Bottom 0.203: v46.33,24.84 46.1,24.61 46.1,14.17 v35.05,3.12
EA13  (via drill 0.25)
  Top 0.203: v39.47,21.57 47.02,21.57 47.02,23.16 IC1.58 | v36.8,16.92 36.42,16.54 IC4.28
  Bottom 0.203: v39.47,21.57 36.8,18.9 v36.8,16.92
EA14  (via drill 0.25)
  Top 0.203: v47.09,24.84 47.55,24.84 47.55,24.31 IC1.59 | v34.29,2.97 33.91,2.59 IC4.3
  Bottom 0.203: v47.09,24.84 46.56,25.38 45.64,25.38 45.64,14.48 34.29,3.12 v34.29,2.97
EA15  (via drill 0.25)
  Top 0.203: v36.65,21.03 48.01,21.03 48.01,23.16 IC1.60 | v32.99,16.92 32.61,16.54 IC4.31
  Bottom 0.203: v36.65,21.03 32.99,17.37 v32.99,16.92
EA16  (via drill 0.25)
  Top 0.203: v32.99,2.97 32.61,2.59 IC4.2 | v49.53,21.57 IC1.63
  Bottom 0.203: v49.53,21.57 46.56,18.59 46.56,13.87 35.13,2.44 32.99,2.44 v32.99,2.97
EA17  (via drill 0.25)
  Top 0.203: v49.99,21.03 50.06,21.03 50.06,23.16 IC1.64 | v47.02,12.27 43.61,8.87 35.13,8.87 31.43,5.16 | 31.43,5.16 31.39,5.13 | 31.43,5.16 31.11,4.84 IC4.1 | 31.43,5.16
  Bottom 0.203: v49.99,21.03 47.02,18.06 v47.02,12.27
EA18  (via drill 0.25)
  Top 0.203: v39.17,20.5 50.52,20.5 50.52,23.16 IC1.65 | v37.39,18.72 36.73,18.06 35.43,18.06 33.91,16.54 IC4.30
  Bottom 0.203: v37.39,18.72 v39.17,20.5
ECLK
  Top 0.203: IC6.2 10.13,41.22 10.13,42.6 IC6.1
  Bottom 0.203: JP1.14 5.49,47.62 9.3,43.81 9.3,43.74 IC6.1
GA1  (via drill 0.25)
  Top 0.203: v54.42,38.63 54.03,38.63 54.03,39.17 IC1.4 | v55.17,42.29 67.67,42.29 68.2,42.82 75.51,42.82 GAME_A.1
  Bottom 0.203: v54.42,38.63 55.17,39.7 v55.17,42.29
GA2  (via drill 0.25)
  Top 0.203: v52.58,38.63 53.49,38.63 53.49,39.17 IC1.5 | v55.17,46.94 56.46,48.23 74.02,48.23 76.15,46.1 GAME_A.2
  Bottom 0.203: v52.58,38.63 52.72,38.77 52.72,44.94 54.77,46.99 55.12,46.99 v55.17,46.94
GA3
  Top 0.203: IC1.6 53.03,40.31 53.03,41.3 67.28,41.3 68.05,40.54 76.38,40.54 78.66,42.82 GAME_A.3
GA4
  Top 0.203: IC1.7 52.5,40.31 52.5,41.76 67.44,41.76 68.2,41 75.91,41 77.57,42.66 77.57,44.35 78.33,45.11 GAME_A.4
GA5  (via drill 0.25)
  Top 0.203: v73.94,44.65 74,44.65 73.23,45.41 68.2,45.41 65.99,43.2 52.05,43.2 52.05,40.31 IC1.8
  Bottom 0.203: v73.94,44.65 73.98,44.62 73.98,44.61 79.85,44.61 GAME_A.5
GA6  (via drill 0.25)
  Top 0.203: v51.51,43.43 51.51,40.31 IC1.9 | v51.51,51.89 52.2,52.58 52.2,58.73 v68,58.73
  Bottom 0.203: v51.51,43.43 v51.51,51.89 | v68,58.73 80.62,46.1 GAME_A.6
GB1  (via drill 0.25)
  Top 0.203: v56.46,28.27 42.14,28.27 IC1.45 | v64.69,35.05 64.85,35.2 70.52,35.2 71.44,34.29 GAME_B.1
  Bottom 0.203: v56.46,28.27 61.11,28.27 61.11,27.05 61.42,26.75 63.02,26.75 63.02,33.38 v64.69,35.05
GB2  (via drill 0.25)
  Top 0.203: v70.03,23.77 57.45,23.77 54.56,26.67 48.31,26.67 47.24,27.74 42.14,27.74 IC1.46
  Bottom 0.203: v70.03,23.77 70.51,24.26 70.51,30.73 75.89,36.12 GAME_B.2
GB3  (via drill 0.25)
  Top 0.203: v50.6,24.84 49.23,26.21 48.16,26.21 47.09,27.28 42.14,27.28 IC1.47 | v52.5,22.02 52.96,21.57 62.81,21.57 63.2,21.95 70.03,21.95 71.75,23.67 71.75,24.45 73.98,26.67 74.77,26.67 v74.77,26.69 v74.78,26.7
  Bottom 0.203: v50.6,24.84 52.5,22.94 v52.5,22.02 | GAME_B.3 77.3,32.49 77.3,27.95 76.02,26.67 74.8,26.67 v74.78,26.7
GB4  (via drill 0.25)
  Top 0.203: v49.76,24.92 48.92,25.76 44.58,25.76 43.59,26.75 42.14,26.75 IC1.48 | v56.24,25.76 57.68,24.31 v61.42,24.31
  Bottom 0.203: v49.76,24.92 50.6,25.76 v56.24,25.76 | v61.42,24.31 63.48,26.36 63.48,33.07 68.51,38.11 70.95,38.11 71.58,38.73 76.83,38.73 GAME_B.4
GB5  (via drill 0.25)
  Top 0.203: v43.74,25.83 43.36,26.21 42.14,26.21 IC1.49 | v52.88,19.43 52.96,19.36 80.31,19.36 83.44,22.48 83.82,22.48 85.34,24 85.34,31.95 85.25,32.05 85.25,32.07 83.91,32.07 81.99,33.98 GAME_B.5
  Bottom 0.203: v43.74,25.83 46.84,25.83 47.47,25.22 52.88,19.81 v52.88,19.43
GB6  (via drill 0.25)
  Top 0.203: v75.15,21.49 67.16,21.49 66.78,21.11 65.63,21.11 64.49,19.96 36.07,19.96 35.16,20.88 35.16,21.27 37.54,23.65 38.58,23.65 40.64,25.72 41.5,25.72 IC1.50
  Bottom 0.203: v75.15,21.49 78.31,24.64 78.31,32.28 80.16,34.14 80.16,35.36 80.92,36.12 GAME_B.6
GND  (via drill 0.25, 0.33, 0.7)
  Top 0.203: C6.1 23.32,41.83 24.77,40.39 29.26,40.39 30.71,38.94 30.71,38.41 IC2.10 30.94,37.03 30.56,36.65 | 30.56,36.65 25.15,36.65 25.15,37.03 IC2.1 | 30.56,36.65 30.56,36.58 v30.79,36.35 32.38,34.75 | 40.92,34.75 IC1.32 42.14,34.75 42.44,34.75 v43.2,33.98 43.97,34.75 53.03,34.75 v54.33,36.04 55.47,37.19 55.47,37.26 | v49.07,24.84 49.07,24.31 IC1.62 | 55.47,37.26 51.66,37.26 50.52,38.41 50.52,39.17 IC1.11 50.52,40.31 50.52,43.97 | 55.47,37.26 56.92,37.26 IC1.99 | RD1.10 68.05,51.82 66.98,51.82 65.61,50.44 IC7.14 64.16,50.14 60.96,50.14 60.35,49.53 56.77,49.53 | IC7.11 65.61,46.1 65.99,46.1 65.99,44.42 65.61,44.04 IC7.9 IC7.8 58.75,44.04 57.76,45.03 56.16,45.03 C21.2 | 54.63,49.15 IC8.2 54.48,50.06 54.1,50.44 52.65,50.44 | C8.1 22.4,25.3 17.98,20.88 IC6.11 | IC6.11 18.97,20.12 23.55,20.12 28.73,14.94 C12.1 29.64,14.86 43.2,14.86 43.59,15.24 IC4.22 44.04,16.54 | 31.01,23.16 31.09,23.16 | IC6.10 11.35,20.34 16.61,20.34 IC6.11 | C4.1 62.1,13.11 62.1,15.85 61.19,15.85 IC5.1 61.11,17.3 60.73,17.68 55.32,17.68 55.32,17.3 IC5.10 | IC4.16 50.44,2.59 51.89,4.04 57.23,4.04 63.4,10.21 63.4,12.12 63.02,12.12 C4.1 | LEFT.G1 86.18,23.09 83.97,20.88 LEFT.G2 83.21,17.37 83.21,16.92 RIGHT.G0 | RIGHT.G0 81.38,14.48 76.66,14.48 76.43,14.25 R4.A 73.46,13.64 63.55,13.64 63.02,13.11 C4.1 | RIGHT.G1 86.18,11.2 83.97,13.41 RIGHT.G0 | IC1.81 58.14,28.27 64.54,28.27 67.36,25.45 68.05,25.45 RD2.10 | 83.82,53.34 83.82,50.98 86.87,50.98 J3.GND1 86.87,50.29 86.72,50.29 86.72,46.41 GAME_A.10 | LEFT.G0 81.38,29.18 76.43,29.18 R7.A 74.73,28.88
  Top 0.61: JP1.1 3.81,64.77 8.89,64.77 C7.2 | J3.GND2 88.76,65.09 v77.47,65.09
  Bottom 0.203: v43.2,33.98 45.26,33.98 C13.2 | C19.2 31.77,33.45 31.77,34.21 C18.2 31.32,35.2 30.79,35.74 v30.79,36.35 | C2.2 53.8,35.43 53.8,34.75 C1.1 54.18,33.83 54.18,29.34 C3.1 54.35,28.79 52.69,27.13 49.61,27.13 C9.1 49.07,26.21 v49.07,24.84 | C5.2 49.23,36.35 49.61,35.97 52.88,35.97 C2.2 | v54.33,36.04 53.8,36.04 C2.2 | C10.2 76.89,19.36 81.38,19.36 LEFT.G2 | C11.2 76.89,4.12 81.38,4.12 81.38,4.42 RIGHT.G2 84.73,6.1 86.94,8.31 86.94,8.38 RIGHT.G1 | 77.42,61.11 77.42,64.62 v77.47,65.09 | ISP.6 46.02,60.43 46.79,61.19 46.79,65.09 | 86.03,50.75 86.03,46.41 GAME_A.10 86.72,45.03 87.48,44.27 87.48,38.41 86.64,37.57 GAME_B.10 86.72,36.12 87.48,35.36 87.48,33.76 84.28,30.56 LEFT.G0 83.9,27.36 83.9,27.28 86.11,25.07 LEFT.G1
  Bottom 0.61: 18.2,65.09 R2.1 C7.2 | 29.21,65.09 46.79,65.09 58.74,65.09 | R3.1 58.84,65.09 58.74,65.09 | 58.74,65.09 v77.47,65.09
  other vias: 35.56,48.26 48.26,50.8 43.18,57.15 52.47,50.24 72.79,36.27 70.25,32.46 71.12,20.32 72.39,44.45 36.91,39.69 22.46,32.38 22.46,37.47 65.64,9.53 65.64,15.88 73.82,22.54 33.66,38.73 40.01,4.45 41.27,24.77 48.9,47.47 59.05,39.85 64.14,39.85 50.8,31.75 8.89,2.54 13.57,24.77 54.53,48.42 63.34,55.32 53.34,57.15 53.02,60.33 40.72,39.69 34.77,22.38 62.71,17.94 63.18,24.77
  pour Bottom: 0,66.04 90.17,66.04 90.17,0 0,0
  pour Top: 0,66.04 90.17,66.04 90.17,0 0,0
GSEL
  Bottom 0.203: GAME_B.7 83.44,34.98 82.75,35.66 82.75,41.68 83.52,42.44 GAME_A.7
LA0  (via drill 0.25)
  Top 0.203: v51.05,20.5 51.05,23.16 IC1.66 | v49.76,19.2 49.76,19.05 46.71,19.05 44.96,17.3 v44.81,17.3 | v39.17,11.66 39.09,11.58 23.7,11.58 22.17,10.06 21.41,10.06 IC9.19
  Bottom 0.203: v49.76,19.2 v51.05,20.5 | v39.17,11.66 v44.81,17.3
LA1  (via drill 0.25)
  Top 0.203: v51.59,22.63 51.51,22.63 51.51,23.16 IC1.67 | v52.5,21.26 52.73,21.03 v54.48,21.03 | v52.88,17.6 v54.48,17.6 | v44.58,11.12 23.93,11.12 22.17,9.37 21.41,9.37 IC9.18
  Bottom 0.203: v51.59,22.63 51.97,22.63 51.97,21.34 52.5,21.34 v52.5,21.26 | v54.48,21.03 54.41,20.95 54.41,17.68 v54.48,17.6 | v52.88,17.6 52.88,18.44 52.81,18.44 52.81,18.52 52.73,18.52 52.73,18.59 52.65,18.59 52.65,18.67 48.23,18.67 48.23,15.7 47.85,15.32 47.85,12.8 48.01,12.65 48.01,11.89 47.24,11.12 v44.58,11.12
LA2  (via drill 0.25)
  Top 0.203: v52.2,24.84 52.05,24.84 52.05,24.31 IC1.68 | v54.94,18.52 54.56,18.14 v52.35,18.14 | v51.36,12.72 51.36,10.59 46.56,10.59 43.97,8 v35.43,8 | v33.22,10.21 33.15,10.13 23.55,10.13 22.17,8.76 21.41,8.76 IC9.17
  Bottom 0.203: v52.2,24.84 55.02,22.02 55.02,20.8 54.94,20.73 v54.94,18.52 | v52.35,18.14 52.05,17.83 52.05,14.25 51.36,13.56 v51.36,12.72 | v33.22,10.21 v35.43,8
LA3  (via drill 0.25)
  Top 0.203: v55.47,20.5 51.97,20.5 51.97,22.25 52.27,22.55 52.5,22.55 52.5,23.16 IC1.69 | v55.85,12.72 v54.48,12.72 | v44.12,10.59 43.2,9.68 23.77,9.68 22.17,8.08 21.41,8.08 IC9.16
  Bottom 0.203: v55.47,20.5 55.47,14.55 54.48,13.56 v54.48,12.72 | v55.85,12.72 55.85,11.73 54.71,10.59 v44.12,10.59
LED  (via drill 0.25)
  Top 0.203: v61.65,27.28 58.14,27.28 IC1.79
  Bottom 0.203: v61.65,27.28 61.72,27.36 61.72,58.9 63.25,60.43 STATUS.A
LOUT
  Bottom 0.203: 71.02,2.59 R6.1
  Bottom 0.61: 71.02,2.59 69.11,2.59 RD2.1
MISO  (via drill 0.25)
  Top 0.203: v45.03,38.63 45.03,39.17 IC1.22 | ISP.1 51.19,62.19 76.36,62.19 76.99,61.57 86.18,61.57 86.18,61.53 87.31,60.4 87.31,53.74 86.39,52.82 J3.7/DAT0
  Bottom 0.203: v45.03,38.63 46.79,40.39 46.79,56.62 49.52,59.35 49.52,60.5 50.52,61.49 ISP.1
MOSI  (via drill 0.25)
  Top 0.203: v45.49,41.07 45.49,40.31 IC1.21 | v56.69,47.7 58.75,47.7 IC7.5 | v45.72,57.81 46.38,57.81 ISP.4 49.45,58.5 v49.45,58.14
  Bottom 0.203: v45.49,41.07 45.72,41.3 v45.72,57.81 | v56.69,47.7 56.16,48.23 56.16,51.44 v49.45,58.14
N$1
  Bottom 0.61: R2.2 PWR.K
N$2
  Bottom 0.203: R6.2 73.76,2.59 | 75.51,2.59 C11.1 76.89,2.82
  Bottom 0.61: 73.76,2.59 75.51,2.59 | 76.89,2.82 78.18,2.82 C16.1
N$3  (via drill 0.25)
  Top 0.203: v77.95,62.1 76.81,63.25 70.41,63.25 ACT.K
  Bottom 0.203: v77.95,62.1 78.64,61.42 R1.2
N$4
  Top 0.203: IC1.33 40.92,34.29 38.73,34.29 36.83,36.2 Q1.2
  Bottom 0.203: C18.1 33.5,36.42 36.27,36.42 Q1.2
N$5  (via drill 0.25)
  Top 0.203: v39.85,33.76 40.92,33.76 IC1.34
  Bottom 0.203: C19.1 33.5,31.62 36.27,31.62 Q1.1 37.03,32.46 37.03,33.76 v39.85,33.76
N$6
  Top 0.203: R7.S 80.7,25.53 81.61,24.61 81.92,24.61 LEFT.V
N$7
  Top 0.61: R4.S 80.7,10.67 81.92,10.67 RIGHT.V
N$8
  Bottom 0.203: R3.2 61.04,63.55 62.94,63.55 STATUS.K
N$10
  Top 0.61: C15.2 78.49,20.88 75.97,23.39 R7.E
N$11
  Bottom 0.203: R5.2 75.06,17.83 | 75.51,17.83 C10.1 76.89,18.06
  Bottom 0.61: 75.06,17.83 75.51,17.83 | 76.89,18.06 78.18,18.06 C15.1
N$12
  Top 0.61: C16.2 78.49,5.64 75.97,8.15 R4.E
N$27  (via drill 0.25)
  Top 0.203: v56.46,36.5 56.69,36.73 56.92,36.73 IC1.98
  Bottom 0.203: v56.46,36.5 56.46,35.2 56.01,34.75 C1.2
PB7  (via drill 0.25)
  Top 0.203: v36.07,40.67 38.12,40.67 40.92,37.87 IC1.26
  Bottom 0.203: AUX.7 32.08,61.49 32.84,60.73 32.84,58.34 32.86,58.33 32.86,49.69 36.07,46.48 v36.07,40.67
PF0  (via drill 0.25)
  Top 0.203: v62.26,36.27 58.14,36.27 IC1.97
  Bottom 0.203: v62.26,36.27 65.75,39.77 65.75,46.47 68.28,49 RD1.9
PF1  (via drill 0.25)
  Top 0.203: v65,35.74 58.14,35.74 IC1.96
  Bottom 0.203: v65,35.74 67.67,38.41 67.67,45.72 68.35,46.41 RD1.8
PF2  (via drill 0.25)
  Top 0.203: v63.7,35.2 63.63,35.28 58.14,35.28 IC1.95 | v67.13,42.82 68.28,43.97 RD1.7
  Bottom 0.203: v63.7,35.2 67.13,38.63 v67.13,42.82
PF3  (via drill 0.25)
  Top 0.203: v62.26,34.52 59.59,34.52 59.36,34.75 58.14,34.75 IC1.94
  Bottom 0.203: v62.26,34.52 66.45,38.71 66.45,46.18 68.2,47.93 69.49,47.93 69.49,43.05 68.89,42.44 RD1.6
PF4  (via drill 0.25)
  Top 0.203: v56.46,34.29 56.92,34.29 IC1.93 | v61.19,39.01 61.27,39.09 68.05,39.09 RD1.5
  Bottom 0.203: v56.46,34.29 v61.19,39.01
PF5  (via drill 0.25)
  Top 0.203: v65.23,33.76 58.14,33.76 IC1.92
  Bottom 0.203: v65.23,33.76 68.05,36.58 RD1.4
PF6
  Top 0.203: IC1.91 58.14,33.22 67.28,33.22 68.05,33.98 RD1.3
PF7
  Top 0.203: IC1.90 58.14,32.77 67.28,32.77 68.05,32 RD1.2
PG3  (via drill 0.25)
  Top 0.203: v39.85,36.73 40.92,36.73 IC1.28
  Bottom 0.203: v39.85,36.73 39.7,36.88 39.7,58.98 AUX.2
PG4  (via drill 0.25)
  Top 0.203: v39.85,36.04 39.93,36.04 40.16,36.27 40.92,36.27 IC1.29
  Bottom 0.203: AUX.4 37.19,58.98 37.87,58.29 37.87,47.38 38.42,46.83 38.42,36.67 39.05,36.04 v39.85,36.04
PG5  (via drill 0.25)
  Top 0.203: v56.16,40.31 55.63,40.31 IC1.1 | v48.02,56.14 47.52,56.64 45.31,56.64 40.08,61.87 AUX.1
  Bottom 0.203: v56.16,40.31 55.7,40.77 55.7,48.46 v48.02,56.14
PH0
  Top 0.203: IC1.12 49.99,40.31 49.99,46.25 27.2,46.25 25.83,44.88 25.83,44.27 IC2.19
PH1
  Top 0.203: IC1.13 49.53,45.8 27.36,45.8 26.44,44.88 26.44,44.27 IC2.18
PH2
  Top 0.203: IC1.14 49,40.31 49,45.34 27.51,45.34 27.13,44.96 27.13,44.27 IC2.17
PH3  (via drill 0.25)
  Top 0.203: v48.54,38.71 48.54,39.17 IC1.15 | v47.32,43.89 47.24,43.97 v31.55,43.97 | v27.74,44.81 27.74,44.27 IC2.16
  Bottom 0.203: v48.54,38.71 47.32,39.93 v47.32,43.89 | v31.55,43.97 31.59,43.97 30.76,44.81 v27.74,44.81
PH4
  Top 0.203: IC1.16 48.01,40.31 48.01,44.65 28.57,44.65 28.19,44.27 IC2.15
PH5  (via drill 0.25)
  Top 0.203: v31.93,43.36 47.55,43.36 47.55,40.31 IC1.17 | v29.18,42.37 29.18,42.52 28.88,42.82 IC2.14
  Bottom 0.203: v29.18,42.37 v29.19,42.37 30.18,43.36 v31.93,43.36
PH6
  Top 0.203: IC1.18 47.02,40.31 47.02,41.6 38.91,41.6 38.84,41.68 30.63,41.68 29.49,42.82 IC2.13
PH7  (via drill 0.25)
  Top 0.203: v32,42.22 30.79,42.22 30.18,42.82 IC2.12 | IC1.27 40.92,37.26 39.57,37.26 38.1,38.73 35.56,38.73 33.15,41.15 v33.07,41.15
  Bottom 0.203: v32,42.22 v33.07,41.15
PK0  (via drill 0.25)
  Top 0.203: v67.06,31.24 65.99,32.31 64.62,32.31 64.54,32.23 58.14,32.23 IC1.89 | v67.06,23.24 67.13,23.16 68.05,23.16 RD2.9
  Bottom 0.203: v67.06,31.24 v67.06,23.24
PK1  (via drill 0.25)
  Top 0.203: v65.91,31.62 65.68,31.85 64.77,31.85 64.69,31.77 58.14,31.77 IC1.88 | v67.13,20.57 68.05,20.57 RD2.8
  Bottom 0.203: v65.91,31.62 66.52,31.01 66.52,21.18 v67.13,20.57
PK2  (via drill 0.25)
  Top 0.203: v65.84,30.94 65.38,31.39 64.92,31.39 64.77,31.24 58.14,31.24 IC1.87 | v67.13,18.82 67.89,18.06 68.05,18.06 RD2.7
  Bottom 0.203: v65.84,30.94 65.91,30.86 65.91,20.04 v67.13,18.82
PK3  (via drill 0.25)
  Top 0.203: v65.15,30.86 65.08,30.79 58.14,30.79 IC1.86 | v65.38,18.67 68.28,15.77 RD2.6
  Bottom 0.203: v65.15,30.86 65.38,30.63 v65.38,18.67
PK4  (via drill 0.25)
  Top 0.203: v68.89,26.44 65,30.33 64.24,30.33 64.16,30.25 58.14,30.25 IC1.85
  Bottom 0.203: v68.89,26.44 69.49,25.83 69.49,13.95 68.81,13.26 RD2.5
PK5  (via drill 0.25)
  Top 0.203: v64.47,29.79 58.14,29.79 IC1.84 | v64.77,13.11 67.44,10.44 68.05,10.44 RD2.4
  Bottom 0.203: v64.47,29.79 64.77,29.49 v64.77,13.11
PK6  (via drill 0.25)
  Top 0.203: v64.01,29.26 58.14,29.26 IC1.83
  Bottom 0.203: v64.01,29.26 64.24,29.03 64.24,8.08 68.2,4.12 69.49,4.12 69.49,6.48 68.89,7.09 RD2.3
PK7  (via drill 0.25)
  Top 0.203: v67.59,25.98 64.85,28.73 63.78,28.73 63.7,28.8 60.81,28.8 60.73,28.73 58.14,28.73 IC1.82
  Bottom 0.203: v67.59,25.98 67.67,25.91 67.67,6.33 68.35,5.64 RD2.2
PL0  (via drill 0.25)
  Top 0.203: v25.38,30.25 28.5,33.38 37.34,33.38 37.49,33.22 40.92,33.22 IC1.35 | v25.45,22.86 25.45,22.17 25.68,21.95 IC3.2
  Bottom 0.203: v25.38,30.25 25.45,30.18 v25.45,22.86
PL1  (via drill 0.25)
  Top 0.203: v28.73,32.84 37.26,32.84 37.34,32.77 40.92,32.77 IC1.36 | v27.89,23.55 26.29,21.95 IC3.3
  Bottom 0.203: v28.73,32.84 28.19,32.31 28.19,23.85 v27.89,23.55
PL2  (via drill 0.25)
  Top 0.203: v40.46,32.23 40.92,32.23 IC1.37 | v31.93,23.55 31.93,18.97 28.35,18.97 26.82,20.5 IC3.4
  Bottom 0.203: v40.46,32.23 31.93,23.7 v31.93,23.55
PL3  (via drill 0.25)
  Top 0.203: v42.6,31.77 42.14,31.77 IC1.38 | v31.01,19.89 30.56,19.43 28.57,19.43 27.51,20.5 IC3.5
  Bottom 0.203: v42.6,31.77 31.01,20.19 v31.01,19.89
PL4  (via drill 0.25)
  Top 0.203: v40.46,31.32 40.54,31.24 40.92,31.24 IC1.39 | v30.33,19.96 30.18,20.12 28.57,20.12 28.19,20.5 IC3.6
  Bottom 0.203: v40.46,31.32 30.33,21.18 v30.33,19.96
PL5  (via drill 0.25)
  Top 0.203: v28.73,30.79 40.92,30.79 IC1.40 | v28.65,22.4 28.88,22.17 28.88,21.95 IC3.7
  Bottom 0.203: v28.73,30.79 28.65,30.71 v28.65,22.4
PL6  (via drill 0.25)
  Top 0.203: v30.86,23.7 29.72,22.55 29.72,21.95 IC3.8 | IC1.41 36.12,30.25 35.88,30 33.81,30 v33.74,29.93
  Bottom 0.203: v33.74,29.93 30.86,27.05 v30.86,23.7
PL7  (via drill 0.25)
  Top 0.203: v30.33,22.4 30.33,21.95 IC3.9 | IC1.42 36.73,29.75 36.2,29.21 32.7,29.21 32.51,29.4 v32.45,29.4
  Bottom 0.203: v32.45,29.4 30.33,27.28 v30.33,22.4
PLE  (via drill 0.25)
  Top 0.203: v42.14,38.41 44.04,38.41 44.04,39.17 IC1.24 | v34.59,27.74 31.01,27.74 IC3.11
  Bottom 0.203: v42.14,38.41 40.39,36.65 40.39,33.53 v34.59,27.74
R//W
  Bottom 0.203: IC6.3 9.22,38.56 5.41,42.37 5.41,42.44 JP1.18
ROUT  (via drill 0.7)
  Top 0.61: v72.31,27.3 70.97,28.65 69.11,28.65 RD1.1
  Bottom 0.61: v72.31,27.3 72.31,18.21 R5.1
RXD0  (via drill 0.25)
  Top 0.203: v55.32,38.63 55.02,38.63 55.02,39.17 IC1.2 | v51.13,63.48 50.83,63.78 34.29,63.78 33.22,62.71 33.22,61.11 35.36,61.11 36.12,61.87 AUX.3
  Bottom 0.203: v55.32,38.63 57.68,41 57.68,56.92 v51.13,63.48
SCK  (via drill 0.25)
  Top 0.203: v46.18,41 46.02,41 46.02,40.31 IC1.20 | v60.5,45.72 60.12,45.34 IC7.7
  Bottom 0.203: v46.18,41 46.25,41.07 46.25,57.09 47.01,57.84 47.01,60.57 47.93,61.49 47.93,61.9 ISP.3 48.26,63.5 49.21,64.45 52.18,64.45 59.37,57.26 59.37,46.83 60.48,45.72 v60.5,45.72
SCL  (via drill 0.25)
  Top 0.203: v42.67,32.69 43.13,32.69 43.13,30.02 42.37,29.26 42.14,29.26 IC1.43 | v42.67,50.9 34.59,58.98 AUX.6
  Bottom 0.203: v42.67,32.69 v42.67,50.9
SDA  (via drill 0.25)
  Top 0.203: v30.33,29.95 31.55,28.73 40.92,28.73 IC1.44
  Bottom 0.203: v30.33,29.95 30.25,30.02 30.25,37.57 33.6,40.92 33.6,45.54 32.08,47.07 32.08,58.98 AUX.8
TXD0  (via drill 0.25)
  Top 0.203: v56.69,40.77 56.62,40.84 54.56,40.84 54.56,40.31 IC1.3 | v51.05,61.04 50.98,61.11 47.78,61.11 46.79,62.1 46.79,63.32 35.74,63.32 34.98,62.56 AUX.5
  Bottom 0.203: v56.69,40.77 57.23,41.3 57.23,54.86 v51.05,61.04
VCC  (via drill 0.25)
  Top 0.203: v56.46,27.58 56.62,27.74 56.92,27.74 IC1.80 | 53.65,49.15 IC8.1 | C21.1 53.65,46.41 | v48.46,25.22 48.54,25.22 48.54,24.31 IC1.61 | IC8.3 55.56,48.34 54.85,47.62 53.65,47.62 | IC9.20 20.27,10.67 20.27,12.27 C23.2 20.42,12.88 v24.99,12.88 | v28.27,16.15 28.73,16.15 C12.2
  Top 0.279: v43.46,35.28 43.49,35.25 IC1.31 | IC1.10 51.03,38.82 51.12,38.73 51.05,38.67 v51.05,38.63 51.91,37.78 57.5,37.78 IC1.100 57.56,37.78 66.36,37.78 66.67,38.1 75.09,38.1 76.68,39.69 86.68,39.69 | 86.68,39.69 88.58,37.78 88.58,36.51 GAME_B.9 | GAME_A.9 86.36,40.01 86.68,39.69 | 24.92,27.15 | 24.92,27.15 IC3.20 | 24.92,26.99 24.92,27.15
  Top 0.305: IC2.20 25.02,44.13 22.86,44.13 | 22.86,27.62 C8.2 | 38.73,26.04 38.79,25.98 v38.88,25.98 | v60.43,13.44 61.04,12.82 61.04,12.38 62.52,10.9 | 62.52,10.9 C4.2 | IC5.20 61.04,10.72 61.22,10.9 62.52,10.9
  Top 0.406: 53.65,46.41 53.65,47.62 53.65,49.15 | 22.86,27.62 24.45,27.62 24.92,27.15 | 33.34,25.24 33.34,19.05 31.11,16.83 IC4.32 29.43,15.88 C12.2 | 33.34,25.24 37.94,25.24 38.73,26.04 | v56.46,27.58 56.34,27.46 56.2,27.46 | v48.23,27.67 48.26,27.64 48.26,27.62 48.42,27.46 | 33.34,25.24 25.56,25.24 24.92,25.88 24.92,26.99
  Top 0.61: JP1.13 3.81,49.53 6.35,49.53 10.16,53.34 C7.1 | C7.1 PWR.A 24.13,59.69 AUX.10 40.16,48.74 50.01,48.74 50.16,48.9 | v53.57,44.5 53.57,45.03 C21.1 | C6.2 22.86,44.13 17.78,44.13 | 17.78,44.13 IC6.20 | 48.42,27.46 56.2,27.46 | ISP.2 50.8,57.47 50.16,56.83 50.16,48.9 | C21.1 | C21.1 53.34,45.72 50.16,48.9 | 17.78,44.13 17.78,45.88 C22.2 17.84,53.28 C7.1
  Bottom 0.203: v60.43,13.44 60.2,13.66 60.2,25.38 58.14,27.43 56.62,27.43 v56.46,27.58 | C13.1 45.26,35.28 | C2.1 53.57,38.18 | v24.99,12.88 v28.27,16.15
  Bottom 0.305: 47.31,26.67 C9.2 | C13.1 45.72,35.24 46.04,35.24 | 50.48,36.83 C5.1 | 48.28,25.4 v48.46,25.22 | 48.26,25.43 48.26,25.4
  Bottom 0.406: v56.46,27.58 55.09,27.58 C3.2 | v38.88,25.98 39,25.98 | 47.31,27.14 47.31,26.67
  Bottom 0.61: 45.26,35.28 v43.46,35.28 | 53.57,38.18 v53.57,44.5 | 46.56,27.89 40.91,27.89 39,25.98 | 46.56,27.89 47.31,27.14 | 46.56,27.89 47.12,28.45 | 47.12,28.45 47.15,28.48 47.15,34.13 46.04,35.24 | C13.1 45.72,36.2 47.47,37.94 50.16,37.94 50.48,37.47 | v51.05,38.63 50.48,38.06 50.48,37.47 | 50.48,37.47 50.48,36.83 51.33,37.68 C2.1 | C9.2 47.47,26.67 47.47,26.22 48.26,25.43 | 47.12,28.45 47.15,28.42 47.48,28.42 v48.23,27.67 | 48.26,25.4 48.28,25.4

### Text on the board
tPlace: MEGA MULTIPASS V1.0 | pugbutt.com